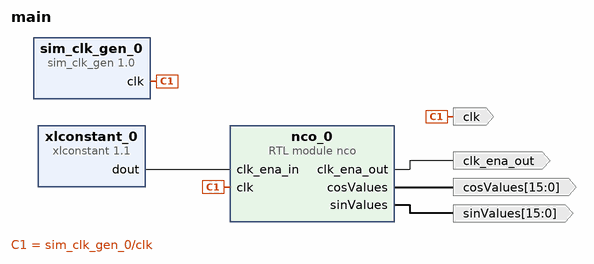
[diagram p0: block diagram of the top level]
# Vivado block design main, xczu48dr-fsvg1517-2-e-es1, Vivado 2020.2
create_bd_design main

create_bd_port -dir O -from 15 -to 0 cosValues
create_bd_port -dir O -from 15 -to 0 sinValues
create_bd_port -dir O clk_ena_out
create_bd_port -dir O clk

create_bd_cell -type ip -vlnv xilinx.com:ip:sim_clk_gen:1.0 sim_clk_gen_0
create_bd_cell -type ip -vlnv xilinx.com:ip:xlconstant:1.1 xlconstant_0
create_bd_cell -type module -reference nco nco_0
set_property -dict {CONFIG.freqSignal 100000} [get_bd_cells nco_0]

# ---- connections ----

connect_bd_net [get_bd_pins sim_clk_gen_0/clk] [get_bd_ports clk] [get_bd_pins nco_0/clk]
connect_bd_net [get_bd_pins xlconstant_0/dout] [get_bd_pins nco_0/clk_ena_in]
connect_bd_net [get_bd_pins nco_0/cosValues] [get_bd_ports cosValues]
connect_bd_net [get_bd_pins nco_0/sinValues] [get_bd_ports sinValues]
connect_bd_net [get_bd_pins nco_0/clk_ena_out] [get_bd_ports clk_ena_out]

validate_bd_design
save_bd_design
